# Altium schematic sheet MAX96751_PINOUT.SchDoc
size C; SheetNumber: 6; SheetTotal: 19
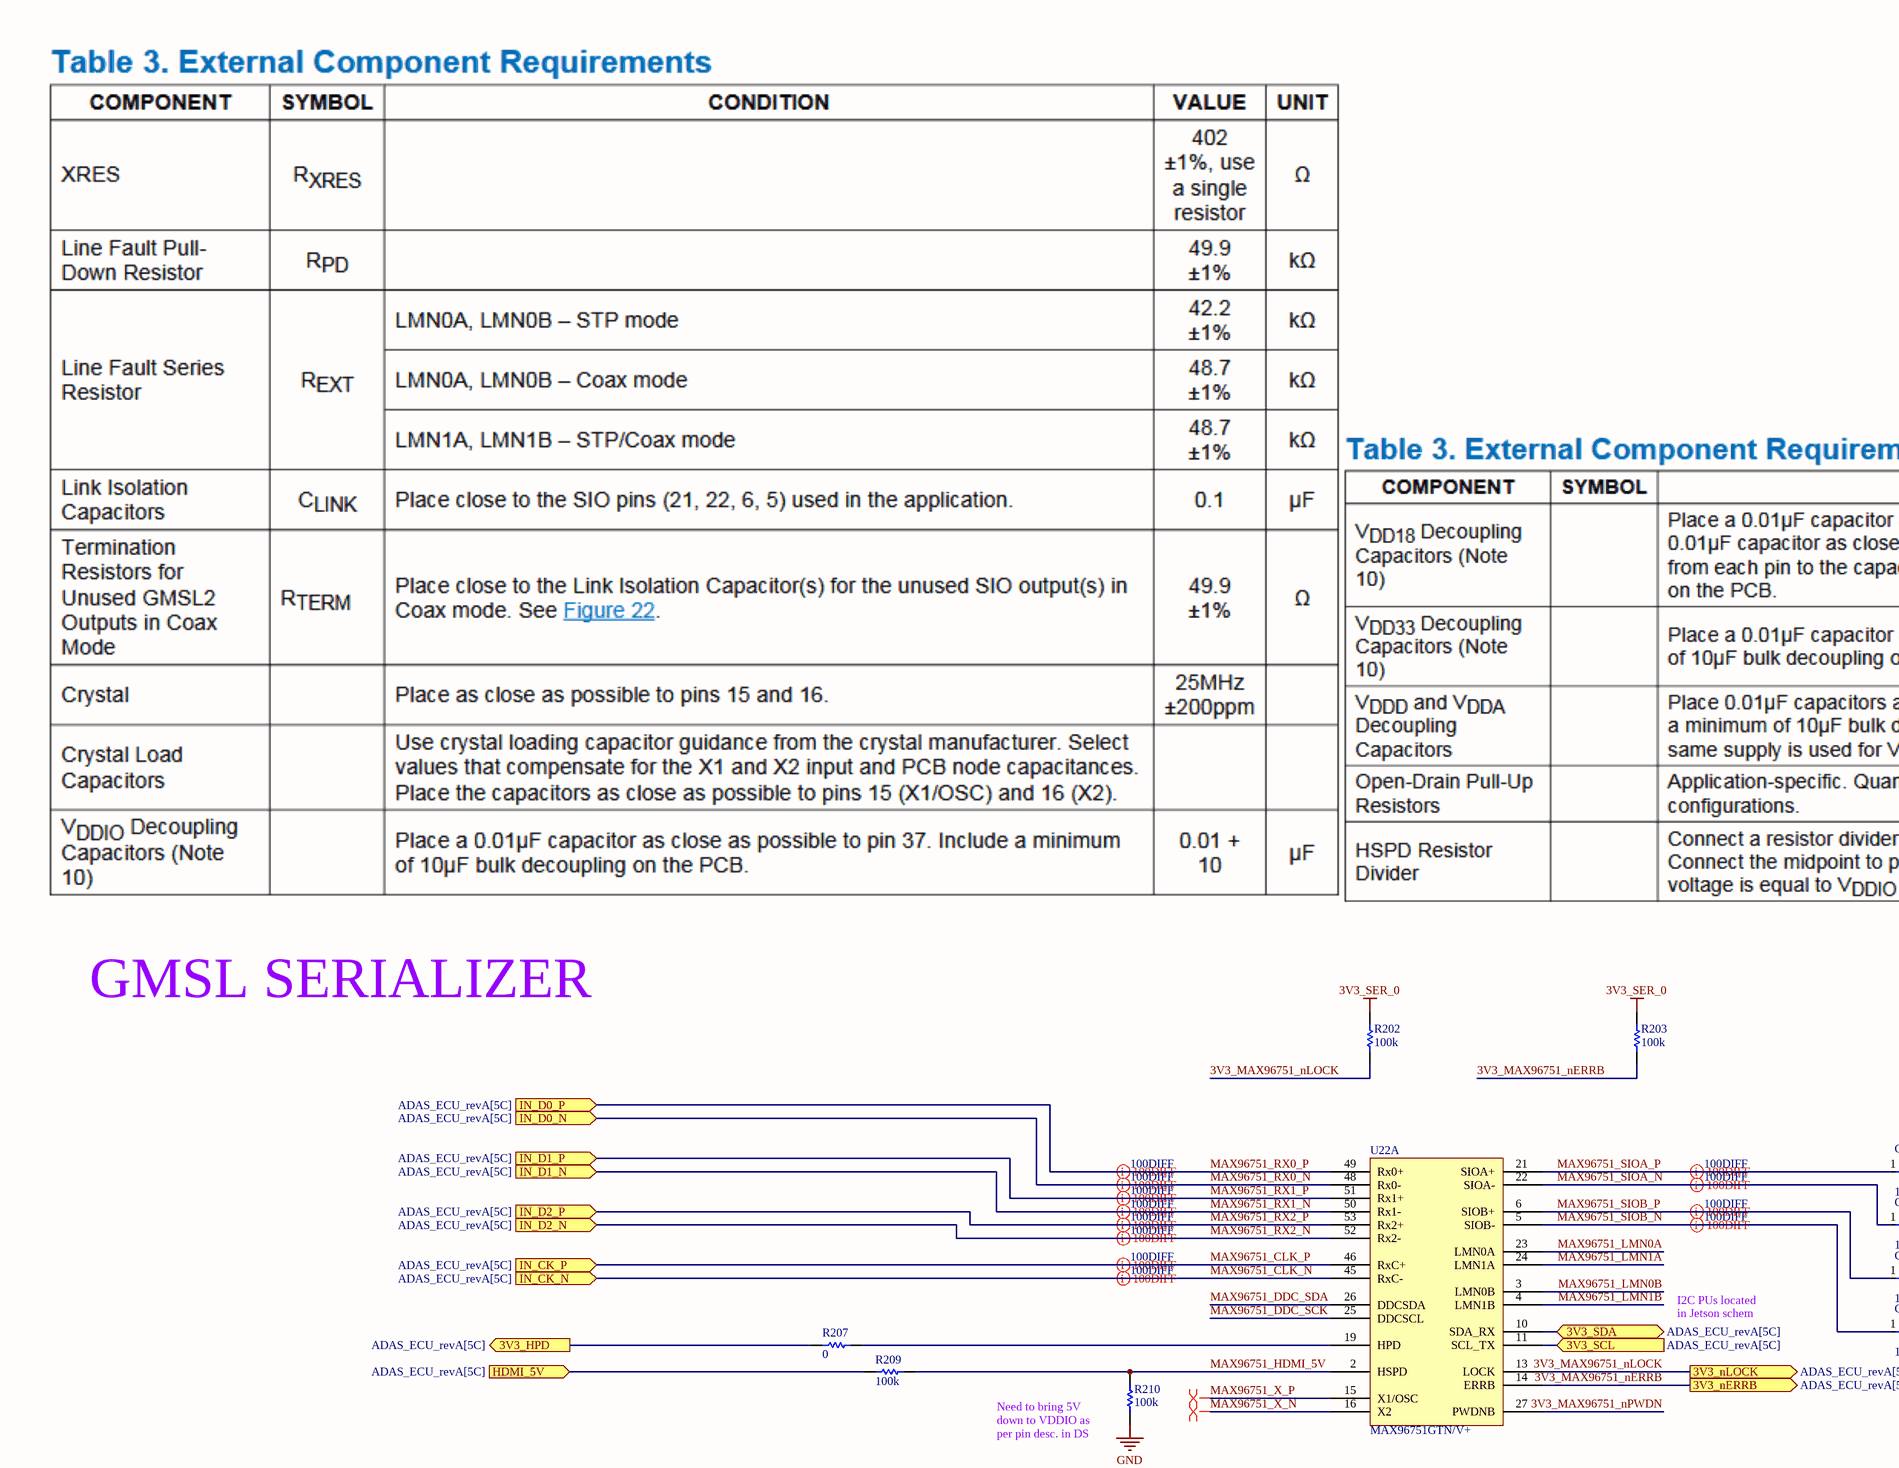
[diagram p0: MAX96751_PINOUT.SchDoc, top left]
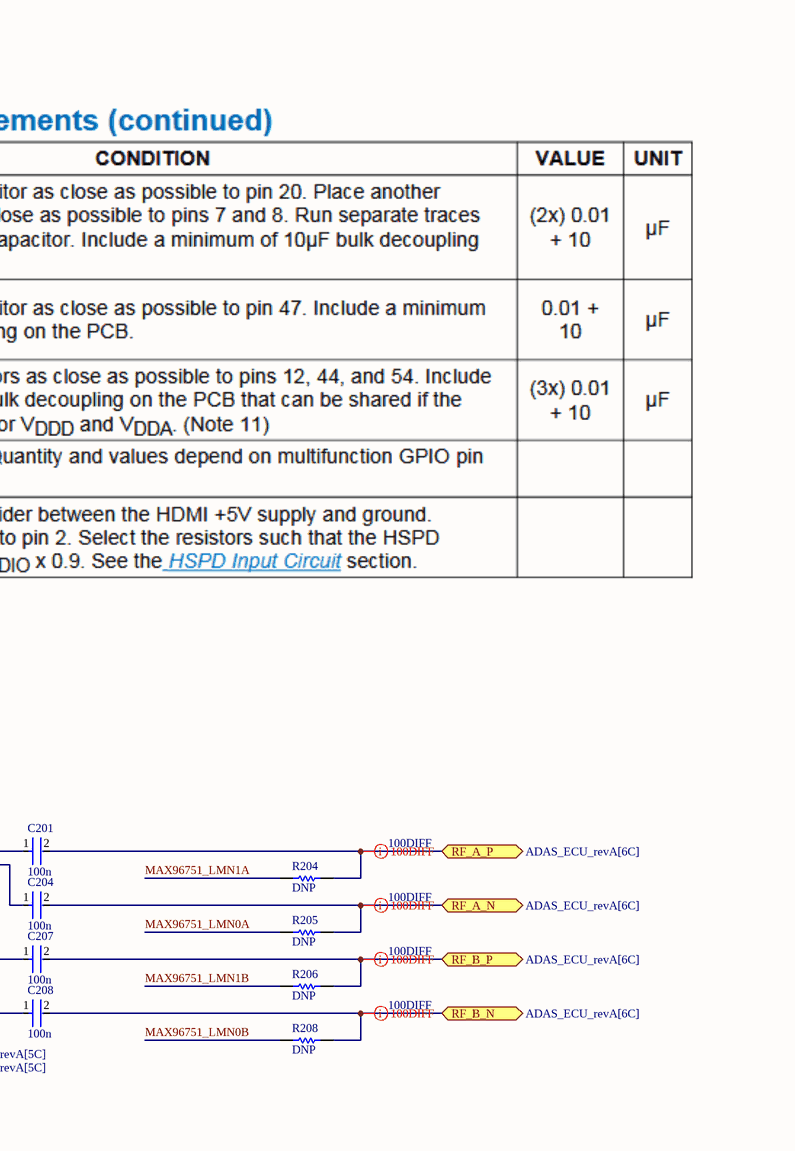
[diagram p1: MAX96751_PINOUT.SchDoc, top right]
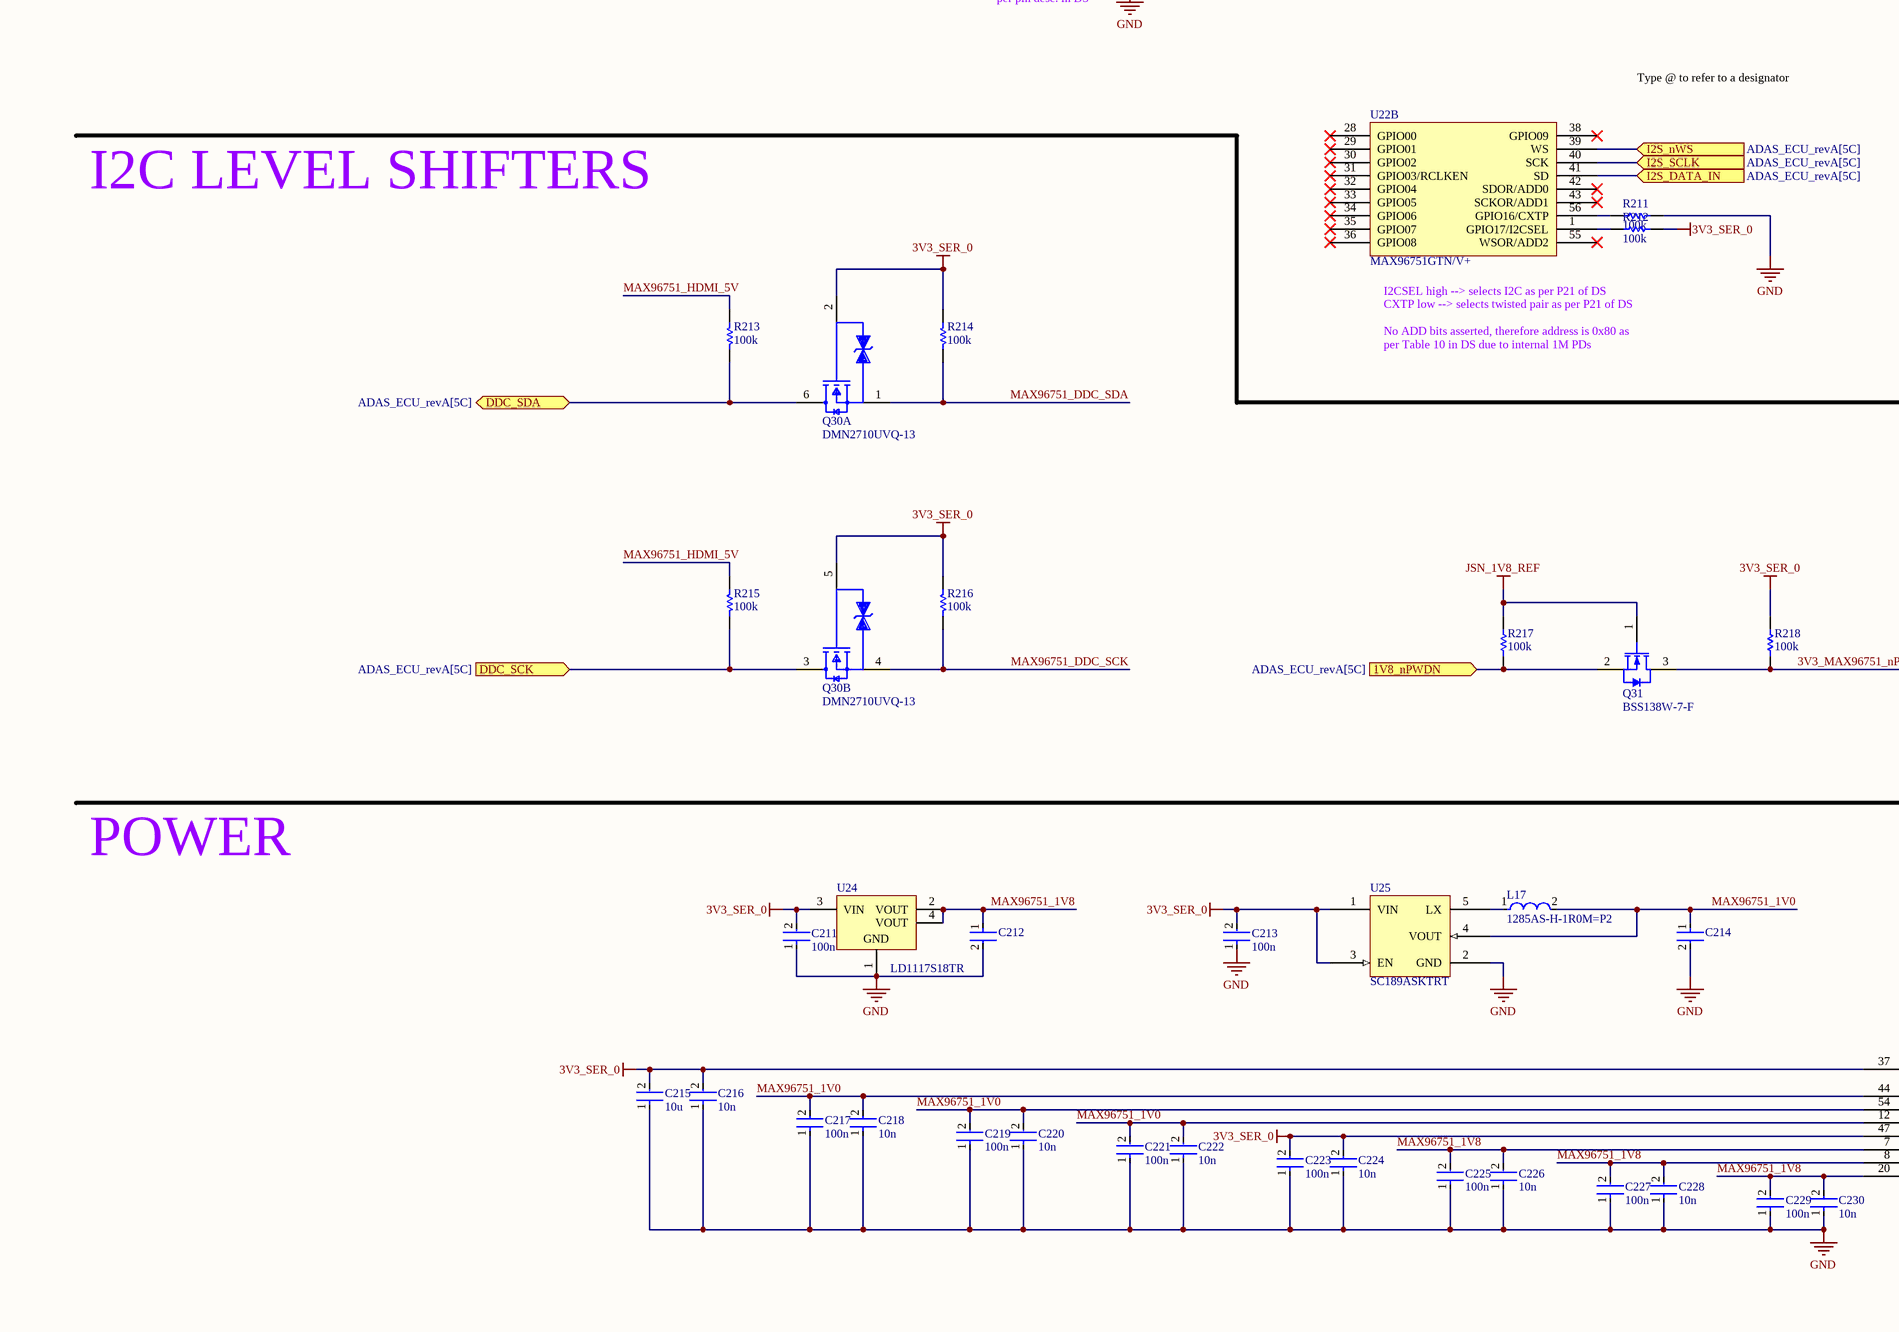
[diagram p2: MAX96751_PINOUT.SchDoc, bottom left]
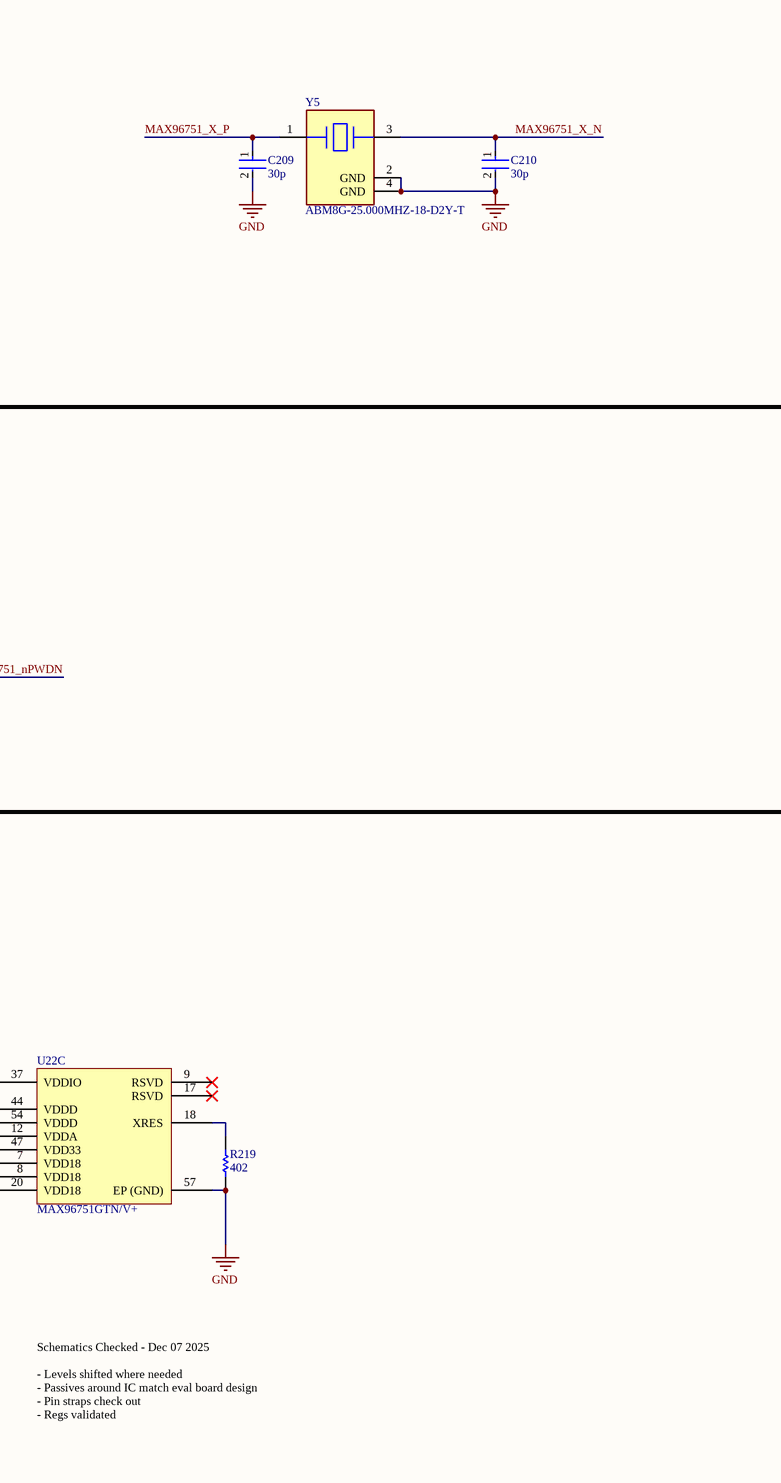
[diagram p3: MAX96751_PINOUT.SchDoc, bottom right]

## Parts
C201  100n  [FP-0402-L_1_0_0_05-W_0_5-IPC_A]
C204  100n  [FP-0402-L_1_0_0_05-W_0_5-IPC_A]
C207  100n  [FP-0402-L_1_0_0_05-W_0_5-IPC_A]
C208  100n  [FP-0402-L_1_0_0_05-W_0_5-IPC_A]
C209  30p  [FP-0402-L_1_0_0_05-W_0_5-IPC_A]
C210  30p  [FP-0402-L_1_0_0_05-W_0_5-IPC_A]
C211  100n  [FP-0402-L_1_0_0_05-W_0_5-IPC_A]
C212  GRM188R60J106ME47D  [FP-GRM188-0_1-e0_2_0_55-IPC_A]  (value not drawn)
C213  100n  [FP-0402-L_1_0_0_05-W_0_5-IPC_A]
C214  GRM21BR61E226ME44L  [FP-GRM21B-0_2-e0_2_0_7-IPC_B]  (value not drawn)
C215  10u  [FP-0402-L_1_0_0_05-W_0_5-IPC_A]
C216  10n  [FP-0402-L_1_0_0_05-W_0_5-IPC_A]
C217  100n  [FP-0402-L_1_0_0_05-W_0_5-IPC_A]
C218  10n  [FP-0402-L_1_0_0_05-W_0_5-IPC_A]
C219  100n  [FP-0402-L_1_0_0_05-W_0_5-IPC_A]
C220  10n  [FP-0402-L_1_0_0_05-W_0_5-IPC_A]
C221  100n  [FP-0402-L_1_0_0_05-W_0_5-IPC_A]
C222  10n  [FP-0402-L_1_0_0_05-W_0_5-IPC_A]
C223  100n  [FP-0402-L_1_0_0_05-W_0_5-IPC_A]
C224  10n  [FP-0402-L_1_0_0_05-W_0_5-IPC_A]
C225  100n  [FP-0402-L_1_0_0_05-W_0_5-IPC_A]
C226  10n  [FP-0402-L_1_0_0_05-W_0_5-IPC_A]
C227  100n  [FP-0402-L_1_0_0_05-W_0_5-IPC_A]
C228  10n  [FP-0402-L_1_0_0_05-W_0_5-IPC_A]
C229  100n  [FP-0402-L_1_0_0_05-W_0_5-IPC_A]
C230  10n  [FP-0402-L_1_0_0_05-W_0_5-IPC_A]
L17  1285AS-H-1R0M=P2  [FP-DFE201610C-MFG]
Q30  DMN2710UVQ-13  [SOTFL50P162X60-6N]  (parts A,B of 2)
Q31  BSS138W-7-F  [DIOD-SOT323-3_V]
R202  100k  [R0603B]
R203  100k  [R0603B]
R204  DNP  [R0603B]
R205  DNP  [R0603B]
R206  DNP  [R0603B]
R207  0  [R0603B]
R208  DNP  [R0603B]
R209  100k  [R0603B]
R210  100k  [R0603B]
R211  100k  [R0603B]
R212  100k  [R0603B]
R213  100k  [R0603B]
R214  100k  [R0603B]
R215  100k  [R0603B]
R216  100k  [R0603B]
R217  100k  [R0603B]
R218  100k  [R0603B]
R219  402  [R0603B]
U22  MAX96751GTN/V+  [QFN50P800X800X80_HS-57N]  (parts A,B,C of 3)
U24  LD1117S18TR  [SOT-223_M]
U25  SC189ASKTRT  [SOT95P275X145-5N]
Y5  ABM8G-25.000MHZ-18-D2Y-T  [FP-ABM8G-MFG]

## Ports
1V8_nPWDN (in, see ADAS_ECU_revA[5C]), 3V3_HPD (out, see ADAS_ECU_revA[5C]), 3V3_nERRB (out, see ADAS_ECU_revA[5C]), 3V3_nLOCK (out, see ADAS_ECU_revA[5C]), 3V3_SCL (in, see ADAS_ECU_revA[5C]), 3V3_SDA (bidir, see ADAS_ECU_revA[5C]), DDC_SCK (in, see ADAS_ECU_revA[5C]), DDC_SDA (bidir, see ADAS_ECU_revA[5C]), HDMI_5V (in, see ADAS_ECU_revA[5C]), I2S_DATA_IN (in, see ADAS_ECU_revA[5C]), I2S_nWS (in, see ADAS_ECU_revA[5C]), I2S_SCLK (in, see ADAS_ECU_revA[5C]), IN_CK_N (in, see ADAS_ECU_revA[5C]), IN_CK_P (in, see ADAS_ECU_revA[5C]), IN_D0_N (in, see ADAS_ECU_revA[5C]), IN_D0_P (in, see ADAS_ECU_revA[5C]), IN_D1_N (in, see ADAS_ECU_revA[5C]), IN_D1_P (in, see ADAS_ECU_revA[5C]), IN_D2_N (in, see ADAS_ECU_revA[5C]), IN_D2_P (in, see ADAS_ECU_revA[5C]), RF_A_N (bidir, see ADAS_ECU_revA[6C]), RF_A_P (bidir, see ADAS_ECU_revA[6C]), RF_B_N (bidir, see ADAS_ECU_revA[6C]), RF_B_P (bidir, see ADAS_ECU_revA[6C])

## Nets
3V3_SER_0: C211.2 C213.2 C215.2 C216.2 C223.2 C224.2 Q30.2(Gate1) Q30.5(Gate2) R202.2 R203.2 R212.2 R214.2 R216.2 R218.2 U22.37(VDDIO) U22.47(VDD33) U24.3(VIN) U25.1(VIN) U25.3(EN)
GND: C209.2 C210.2 C211.1 C212.2 C213.1 C214.2 C215.1 C216.1 C217.1 C218.1 C219.1 C220.1 C221.1 C222.1 C223.1 C224.1 C225.1 C226.1 C227.1 C228.1 C229.1 C230.1 R210.2 R211.2 R219.2 U22.57(EP_(GND)) U24.1(GND) U25.2(GND) Y5.2(GND) Y5.4(GND)
JSN_1V8_REF: Q31.1(G) R217.2
1V8_nPWDN: Q31.2(S) R217.1 ; port 1V8_nPWDN
3V3_HPD: R207.2 ; port 3V3_HPD
3V3_MAX96751_nERRB: R203.1 U22.14(ERRB) ; port 3V3_nERRB
3V3_MAX96751_nLOCK: R202.1 U22.13(LOCK) ; port 3V3_nLOCK
3V3_MAX96751_nPWDN: Q31.3(D) R218.1 U22.27(PWDNB)
3V3_SCL: U22.11(SCL_TX) ; port 3V3_SCL
3V3_SDA: U22.10(SDA_RX) ; port 3V3_SDA
DDC_SCK: Q30.3(Drain2) R215.1 ; port DDC_SCK
DDC_SDA: Q30.6(Drain1) R213.1 ; port DDC_SDA
HDMI_5V: R209.2 ; port HDMI_5V
I2S_DATA_IN: U22.41(SD) ; port I2S_DATA_IN
I2S_nWS: U22.39(WS) ; port I2S_nWS
I2S_SCLK: U22.40(SCK) ; port I2S_SCLK
MAX96751_1V0: C214.1 C217.2 C218.2 C219.2 C220.2 C221.2 C222.2 L17.2 U22.12(VDDA) U22.44(VDDD) U22.54(VDDD) U25.4(VOUT)
MAX96751_1V8: C212.1 C225.2 C226.2 C227.2 C228.2 C229.2 C230.2 U22.7(VDD18) U22.8(VDD18) U22.20(VDD18) U24.2(VOUT) U24.4(VOUT)
MAX96751_CLK_N: U22.45(RxC-) ; port IN_CK_N
MAX96751_CLK_P: U22.46(RxC+) ; port IN_CK_P
MAX96751_DDC_SCK: Q30.4(Source2) R216.1 U22.25(DDCSCL)
MAX96751_DDC_SDA: Q30.1(Source1) R214.1 U22.26(DDCSDA)
MAX96751_HDMI_5V: R209.1 R210.1 R213.2 R215.2 U22.2(HSPD)
MAX96751_LMN0A: R205.2 U22.23(LMN0A)
MAX96751_LMN0B: R208.2 U22.3(LMN0B)
MAX96751_LMN1A: R204.2 U22.24(LMN1A)
MAX96751_LMN1B: R206.2 U22.4(LMN1B)
MAX96751_RX0_N: U22.48(Rx0-) ; port IN_D0_N
MAX96751_RX0_P: U22.49(Rx0+) ; port IN_D0_P
MAX96751_RX1_N: U22.50(Rx1-) ; port IN_D1_N
MAX96751_RX1_P: U22.51(Rx1+) ; port IN_D1_P
MAX96751_RX2_N: U22.52(Rx2-) ; port IN_D2_N
MAX96751_RX2_P: U22.53(Rx2+) ; port IN_D2_P
MAX96751_SIOA_N: C204.1 U22.22(SIOA-)
MAX96751_SIOA_P: C201.1 U22.21(SIOA+)
MAX96751_SIOB_N: C208.1 U22.5(SIOB-)
MAX96751_SIOB_P: C207.1 U22.6(SIOB+)
MAX96751_X_N: C210.1 U22.16(X2) Y5.3
MAX96751_X_P: C209.1 U22.15(X1/OSC) Y5.1
RF_A_N: C204.2 R205.1 ; port RF_A_N
RF_A_P: C201.2 R204.1 ; port RF_A_P
RF_B_N: C208.2 R208.1 ; port RF_B_N
RF_B_P: C207.2 R206.1 ; port RF_B_P
NetL17_1: L17.1 U25.5(LX)
NetR207_1: R207.1 U22.19(HPD)
NetR211_1: R211.1 U22.56(GPIO16/CXTP)
NetR212_1: R212.1 U22.1(GPIO17/I2CSEL)
NetR219_1: R219.1 U22.18(XRES)

Not connected (* = marked no-connect by the designer): U22 9(RSVD)* 17(RSVD)* 28(GPIO00)* 29(GPIO01)* 30(GPIO02)* 31(GPIO03/RCLKEN)* 32(GPIO04)* 33(GPIO05)* 34(GPIO06)* 35(GPIO07)* 36(GPIO08)* 38(GPIO09)* 42(SDOR/ADD0)* 43(SCKOR/ADD1)* 55(WSOR/ADD2)*

## Layout directives
differential pair: MAX96751_X_N, MAX96751_X_P
differential pair; differential pair class 100DIFF: MAX96751_CLK_N, MAX96751_CLK_P, MAX96751_RX0_N, MAX96751_RX0_P, MAX96751_RX1_N, MAX96751_RX1_P, MAX96751_RX2_N, MAX96751_RX2_P, MAX96751_SIOA_N, MAX96751_SIOA_P, MAX96751_SIOB_N, MAX96751_SIOB_P, RF_A_N, RF_A_P, RF_B_N, RF_B_P

## Notes on the sheet
- GMSL SERIALIZER
- I2C PUs located in Jetson schem
- (near R210) Need to bring 5V down to VDDIO as per pin desc. in DS
- Type @ to refer to a designator
- I2C LEVEL SHIFTERS
- I2CSEL high --> selects I2C as per P21 of DS
  CXTP low --> selects twisted pair as per P21 of DS
  No ADD bits asserted, therefore address is 0x80 as per Table 10 in DS due to internal 1M PDs
- POWER
- Schematics Checked - Dec 07 2025
  - Levels shifted where needed
  - Passives around IC match eval board design
  - Pin straps check out
  - Regs validated

## Library data of the parts
C201 C204 C207-C211 C213 C215-C230 = CMP-001-00058-1: LARGE PADS, 0402 CAP, CHANGE COMMENT TO MATCH REAL P/N; Capacitor Type: Ceramic; Min Operating Temperature: -55°C; Mounting Technology: Surface Mount; Pins: 2; Case/Package: 0402; RoHS Compliant: Yes; Max Operating Temperature: 85°C
C212 = CMP-2006-02792-2: Chip Multilayer Ceramic Capacitors for General Purpose, 0603, 10uF, X5R, 15%, 20%, 6.3V; Packaging: Tape and Reel; Voltage Rating (DC): 6.3V; Width: 0.031inch; Termination: SMD/SMT; Dielectric: X5R; Package Quantity: 4000; Voltage Rating: 6.3V; Capacitance: 10uF; Case/Package: 0603; Min Operating Temperature: -55°C; Voltage: 6.3V; Length: 1.6mm; Thickness: 0.035inch; Lead Free: Lead Free; Depth: 0.8mm; Case Code (Imperial): 0603; Max Operating Temperature: 85°C; Material: Ceramic; Height: 0.8mm; Tolerance: 20%; Mount: Surface Mount; REACH SVHC: No SVHC; Radiation Hardening: No; Case Code (Metric): 1608
C214 = CMP-2007-03222-3: Chip Multilayer Ceramic Capacitors for General Purpose, 0805, 22uF, X5R, 15%, 20%, 25V; Case/Package: 0805; Depth: 1.25mm; Resistor Type: Ceramic; Voltage Rating: 25V; Lead Free: Lead Free; Voltage Rating (DC): 25V; Case Code (Metric): 2012; Thickness: 0.057inch; REACH SVHC: No SVHC; Material: Ceramic; Tolerance: 20%; Length: 2mm; Capacitance: 22uF; Case Code (Imperial): 0805; Max Operating Temperature: 85°C; Termination: SMD/SMT; Weight: 0.000335oz; Dielectric: X5R; Packaging: Tape and Reel; Voltage: 25V; Package Quantity: 3000; Height: 1.25mm; Mount: Surface Mount; Width: 1.25mm; Min Operating Temperature: -55°C
L17 = CMP-06042-000137-1: FIXED IND 1UH 2.2A 96 MOHM SMD; Max DC Current: 2.3A; Shielding: Shielded; Test Frequency: 1MHz; Core Material: Ferrite; Tolerance: 20%; DC Resistance (DCR): 96mR; Case Code (Metric): 2012; Case/Package: 0805; Case Code (Imperial): 0805; Resistor Type: Wirewound; Depth: 1.6mm; Width: 0.063inch; Inductance: 1uH; Max Operating Temperature: 85°C; Length: 0.079inch; Lead Free: Lead Free; Height - Seated (Max): 0.039inch; Current Rating: 2.2A; Min Operating Temperature: -40°C; Mount: Surface Mount; Packaging: Tape and Reel
Q30 = CMP-013-00023-2: MOSFET Array, Dual N Channel, 20 V, 920 mA, 450 Milliohms, SOT-563, 6 Pins; Max Operating Temperature: 150°C; Min Operating Temperature: -55°C
Q31 = CMP-2000-05968-1: N-Channel Enhancement Mode Mosfet, 50 V, 200 mA, -55 to 150 degC, 6-Pin SOT-323, RoHS, Tape and Reel; Typical Turn-Off Delay Time: 20ns; Number of Channels: 1Channel; Type: EnhancementModeFieldEffectTransistor; Brand: DiodesIncorporated; Vds - Drain-Source Breakdown Voltage: 75V; Vgs - Gate-Source Voltage: 20V; Rds On - Drain-Source Resistance: 1.4Ohms; Transistor Type: 1N-Channel; Configuration: Single; Unit Weight: 0.000212oz; Pd - Power Dissipation: 200mW; Id - Continuous Drain Current: 200mA; Forward Transconductance - Min: 0.1S; Manufacturer URL: http://www.diodes.com/; Series: BSS138; Package Description: 3-Pin Small Outline Transistor, Body 2 x 1.25 mm, Pitch 0.65 mm; Mounting Technology: SurfaceMount; Product Category: MOSFET; RoHS: True; Maximum Operating Temperature: +150C; Height: 1mm; Length: 2.2mm; Technology: Si; Width: 1.35mm; Datasheet URL: http://www.diodes.com/_files/datasheets/ds30206.pdf; Manufacturer: DiodesIncorporated; Package / Case: SOT-323-3; Typical Turn-On Delay Time: 20ns; Transistor Polarity: N-Channel; Factory Pack Quantity: 3000; Packaging: Reel; Product: MOSFETSmallSignal; Datasheet Version: Rev. 11-2, 09/2013; Package Reference: SOT323; Minimum Operating Temperature: -55C; Mounting Style: SMD/SMT; Channel Mode: Enhancement
R202-R219 = CMP-009-00002-14: Resistor
U22 = CMP-015-00018-2: GMSL2 Serializer with HDMI 2.0 Input
U24 = CMP-0244-00308-1: Fixed Low Drop Positive Voltage Regulator, 1.8V, 4-Pin SOT-223, Tape and Reel; ComponentLink1URL: http://www.st.com; PackageReference: SOT-223; PackageDescription: 4-Pin SOT-223 Package, 6.5 x 3.5 mm Body, 2.3 mm Pitch, 7 mm Lead Span; ComponentLink2URL: http://www.st.com/internet/com/TECHNICAL_RESOURCES/TECHNICAL_LITERATURE/DATASHEET/CD00000544.pdf; ComponentLink2Description: Datasheet; ComponentLink1Description: Manufacturer URL; DatasheetVersion: 1/11/2011; PackageVersion: 2010
U25 = CMP-019-00061-1: Switching Regulator, Voltage-mode, 1.5A, 3000kHz Switching Freq-Max, PDSO5; Max Supply Voltage: 5.5V; Output Voltage: 1V; Mounting Technology: Surface Mount; Case/Package: SOT-23-5; Min Operating Temperature: -40°C; Max Operating Temperature: 85°C; Pins: 6
Y5 = CMP-2000-05733-3: Crystal 25MHz ±20ppm (Tol) ±30ppm (Stability) 18pF FUND 60Ω 4-Pin SMD T/R; Series Resistance: 60R; Length: 3.2mm; Depth: 2.5mm; Packaging: Tape and Reel; Min Operating Temperature: -40°C; Operating Frequency: 25 MHz; Lead Free: Lead Free; Number of Pins: 4; Frequency Tolerance: 20ppm; Radiation Hardening: No; Max Operating Temperature: 85°C; Termination: SMD/SMT; Frequency Stability: 30ppm; Frequency: 25MHz; Series: ABM8G; Mount: Surface Mount; Package Quantity: 1000; Height: 0.039inch; Width: 0.098inch; Case/Package: CSMD; ESR (Equivalent Series Resistance): 60R; Load Capacitance: 18pF; Tolerance: 20ppm